# Altium schematic sheet ReboostV2__Isense.SchDoc: Current Sesnor
size 420 x 297 mm; SheetNumber: 4
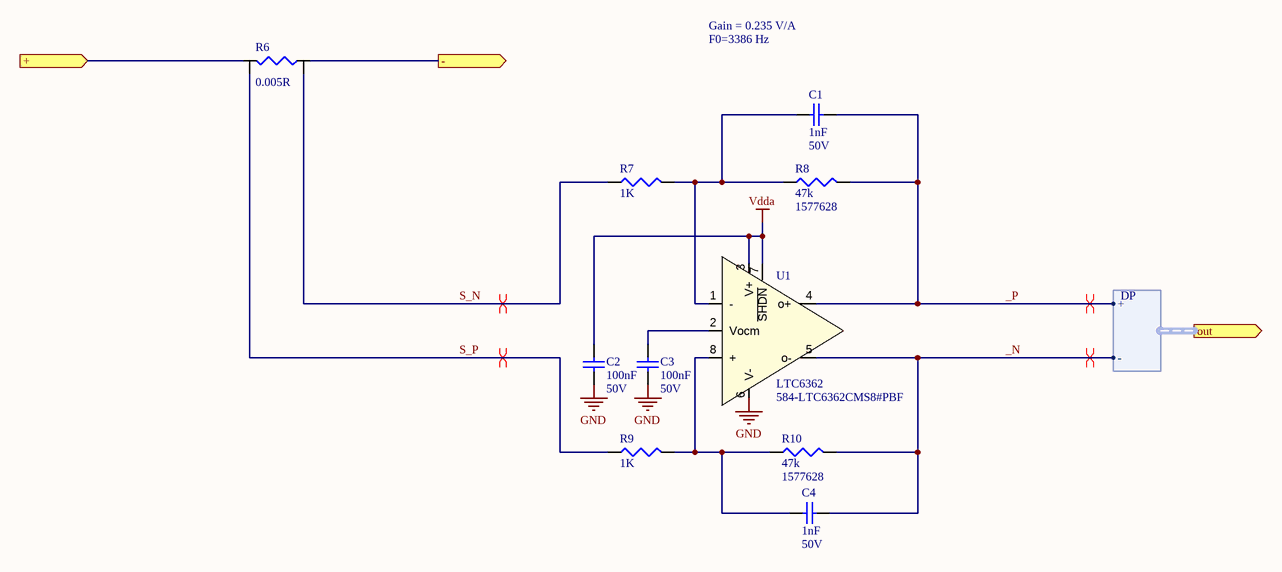
[diagram p0: ReboostV2__Isense.SchDoc]

## Parts
C1  1nF  Voltage Rating: 50V  [C0603]
C2  100nF  Voltage Rating: 50V  [C0603]
C3  100nF  Voltage Rating: 50V  [C0603]
C4  1nF  Voltage Rating: 50V  [C0603]
R6  0.005R  [2512-L-4T]
R7  1K  [0603]
R8  47k  Supplier Part Number 1: 1577628  [0603]
R9  1K  [0603]
R10  47k  Supplier Part Number 1: 1577628  [0603]
U1  LTC6362  Supplier Part Number 1: 584-LTC6362CMS8#PBF  [MSOP8]

## Ports
+ (in), - (out), out (out, harness DP)

## Harnesses
DP: +, -

## Nets
GND: C2.1 C3.1 U1.6(V-)
Vdda: C2.2 U1.3(V+) U1.7(~{SHDN})
+: R6.1 ; port +
-: R6.2 ; port -
_N: C4.2 R10.2 U1.5(o-) ; port out.-
_P: C1.2 R8.2 U1.4(o+) ; port out.+
S_N: R6.4 R7.1
S_P: R6.3 R9.1
NetC1_1: C1.1 R7.2 R8.1 U1.1(-)
NetC3_2: C3.2 U1.2(Vocm)
NetC4_1: C4.1 R9.2 R10.1 U1.8(+)

## Layout directives
differential pair: _N, _P, S_N, S_P

## Notes on the sheet
- Gain = 0.235 V/A
- F0=3386 Hz
- PROJECT
- www.tpee.nl <http://www.tpee.nl>
- TITLE
- FILE NAME
- A3
- SIZE
- Author:
- SHEET
- OF

## Library data of the parts
C1 C4 = 1nF/0603/CER/50V: Capacitor, 1nF, 50V, X7R; Capacitance Tolerance: ± 10%; Capacitor Case Style: 0603; Brand Number: C0603C102K5RACTU; Brand: KEMET; Dielectric Characteristic: X7R; Capacitance: 1nF; Temperature Range: -55°C to +125°C; Price: 0,011; Order Code Supplier: 1414608; Supplier: Farnell; Manufacturer: KEMET; Manufacturer Part Number: C0603C102K5RACTU
C2 C3 = 100nF/0603/CER/50V: Capacitor, 100nF, 50V, X7R; Capacitance Tolerance: ± 10%; Capacitor Case Style: 0603; Brand Number: MCCA000255; Brand: MULTICOMP; Dielectric Characteristic: X7R; Capacitance: 100nF; Temperature Range: -55°C to +125°C; Price: 0,008; Order Code Supplier: 1759122RL; Supplier: Farnell; Manufacturer: MULTICOMP; Manufacturer Part Number: MCCA000255
R6 = 0.005/2512/2000W/200V: Resistor, 0.005R, 1%, 2W, 50PPM; Brand: OHMITE; Brand Number: FC4L64R005FER; Case Style: 2512; Voltage Rating: 200V; Order Code Supplier: 2363991; Power Rating: 2W; Price: 3,07; Resistance: 0.005R; Supplier: Farnell; Temperature Coefficient: ± 50PPM; Temperature Range: -55°C to +170°C; Manufacturer: OHMITE; Manufacturer Part Number: FC4L64R005FER
R7 R9 = 1K/0603/0063W/50V: Resistor, 1K, 1%, 0.063W, 50V, 100PPM, 0603; Brand: VISHAY DRALORIC; Brand Number: CRCW06031K00FKEA; Case Style: 0603; Order Code Supplier: 2122366; Power Rating: 0.063W; Price: 0,039; Resistance: 1K; Supplier: Farnell; Temperature Coefficient: ± 100PPM; Temperature Range: -55°C to +125°C; Voltage Rating: 50V; Manufacturer: VISHAY DRALORIC; Manufacturer Part Number: CRCW06031K00FKEA
R8 R10 = 47K/0603/0063W/50V_1: Resistor, 47K, 0.1%, 0.063W, 50V, 100PPM, 0603; Manufacturer: PANASONIC; Manufacturer Part Number: ERA3AEB473V; Case Style: 0603; Order Code Supplier: ERA3AEB473V; Power Rating: 0.063W; Resistance: 47k; Supplier: Farnell; Temperature Coefficient: ± 100PPM; Temperature Range: -55°C to +125°C; Voltage Rating: 50V; Supplier 1: Farnell
U1 = LTC6362HMS8: Precision, Low Power Rail-to-Rail Input/Output Differential Op Amp; Manufacturer: Analog Devices Inc.; Manufacturer Part Number: LTC6362HMS8#PBF; Supplier 1: Mouser